# Altium schematic sheet USBC.SchDoc: Title
size A4; Date: *******; ApprovedBy: *******; CheckedBy: None; Author: *******; CompanyName: *******; DrawnBy: Jacob Chisholm; Engineer: *******; Organization: *******; Address1: *******; Address2: *******; Address3: *******; Address4: *******; DocumentNumber: 2; Revision: *******; SheetNumber: 2; SheetTotal: 2; Address_Website: https://jchisholm204.github.io; E-Mail: JacobChisholm1010@gmail.com; CurrentTime: *******; CurrentDate: *******; Time: *******; DocumentFullPathAndName: *******; DocumentName: *******; ModifiedDate: *******; ImagePath: *******; ProjectName: *******; Application_BuildNumber: *******
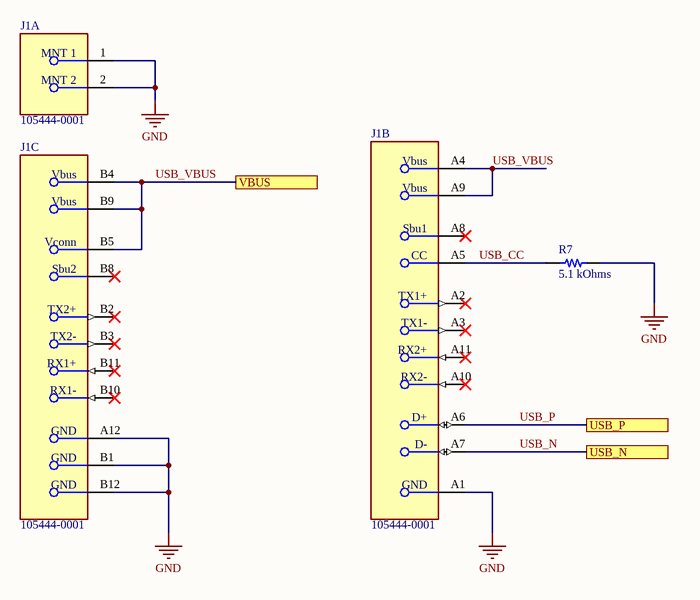
[diagram p0: USBC.SchDoc]

## Parts
J1  105444-0001  [FP-105444-0001-MFG]  (parts A,B,C of 3)
R7  5.1 kOhms  [RES 0603_1608]

## Ports
USB_N, USB_P, VBUS

## Nets
GND: J1.1(MNT_1) J1.2(MNT_2) J1.A1(GND) J1.A12(GND) J1.B1(GND) J1.B12(GND) R7.2
USB_CC: J1.A5(CC) R7.1
USB_N: J1.A7(D-) ; port USB_N
USB_P: J1.A6(D+) ; port USB_P
USB_VBUS: J1.A4(Vbus) J1.A9(Vbus) J1.B4(Vbus) J1.B5(Vconn) J1.B9(Vbus) ; port VBUS

Not connected (* = marked no-connect by the designer): J1 A2(TX1+)* A3(TX1-)* A8(Sbu1)* A10(RX2-)* A11(RX2+)* B2(TX2+)* B3(TX2-)* B8(Sbu2)* B10(RX1-)* B11(RX1+)*

## Notes on the sheet
- Title:
- Drawn By:
- Page Contents:
- Checked By:
- Size:
- Date:
- File:
- License:
- Email:
- A4
- Number:
- Time:
- Revision:
- Sheet
- Website:
- of

## Library data of the parts
J1 = CMP-04767-000023-1: CONN PLUG USB3.1 TYPEC BRD EDGE; Number of Terminals/Pins: 22; Number of Ports: 1; Pitch: 0.5mm; Current Rating: 5A; Connector Type: USB; Number of Contacts: 24; Gender: Male; Mating Cycles: 10000; Shielding: Shielded; Contact Plating: Gold; Flammability Rating: UL94 V-0; Contact Material: Copper Alloy; RoHS Compliant: Yes; Max Operating Temperature: 85°C; Features: Shielded; USB Standard: USB 3.1; Housing Material: Thermoplastic; Packaging: Tray; Number of Pins: 22; Orientation: Right Angle; Min Operating Temperature: -30°C; Insulation Color: Black; Mount: Straddle Mount; Length: 9.18mm; Termination: Solder; Series: 105444
R7 = TNPW06035K10BYEN: RES 5.1K OHM 0.1% 1/10W 0603; Manufacturer: Vishay Dale; Power (Watts): 0.125W, 1/8W; Temperature Coefficient: ±10ppm/°C; Part Number: TNPW06035K10BYEN; Value: 5.1 kOhms; ComponentLink1Description: Datasheet; ComponentLink1URL: http://www.vishay.com/docs/28758/tnpw_e3.pdf; ComponentLink2Description: DigiKey Link; ComponentLink2URL: http://digikey.com/product-detail/en/vishay-dale/TNPW06035K10BYEN/541-9831-1-ND/9562456; Composition: Thin Film; Device Package: 0603 (1608 Metric); Features: Anti-Sulfur, Automotive AEC-Q200, Moisture Resistant; Height - Seated (Max): 0.022" (0.55mm); LastUpdated: 2/9/2024 8:43:35 PM; Lifecycle Status: Active; Minimum Order: 1; Number of Terminations: 2; Operating Temperature: -55°C ~ 155°C; Package / Case: 0603 (1608 Metric); Packaging: TapeAndReel; PartId: 5273; Part Status: Active; Price: 0.27; Ratings: AEC-Q200; Resistance: 5.1 kOhms; Series: TNPW e3; Size / Dimension: 0.061" L x 0.033" W (1.55mm x 0.85mm); Supplier 1: DigiKey; Supplier Part Number 1: 541-9831-1-ND; Supplier Device Package: 0603; Tolerance: ±0.1%